# Altium project KX1_DB.PrjPcb (part 2 of 2)

## Sheet KX1_DB_EX_CONN.SchDoc
size 508 x 381 mm
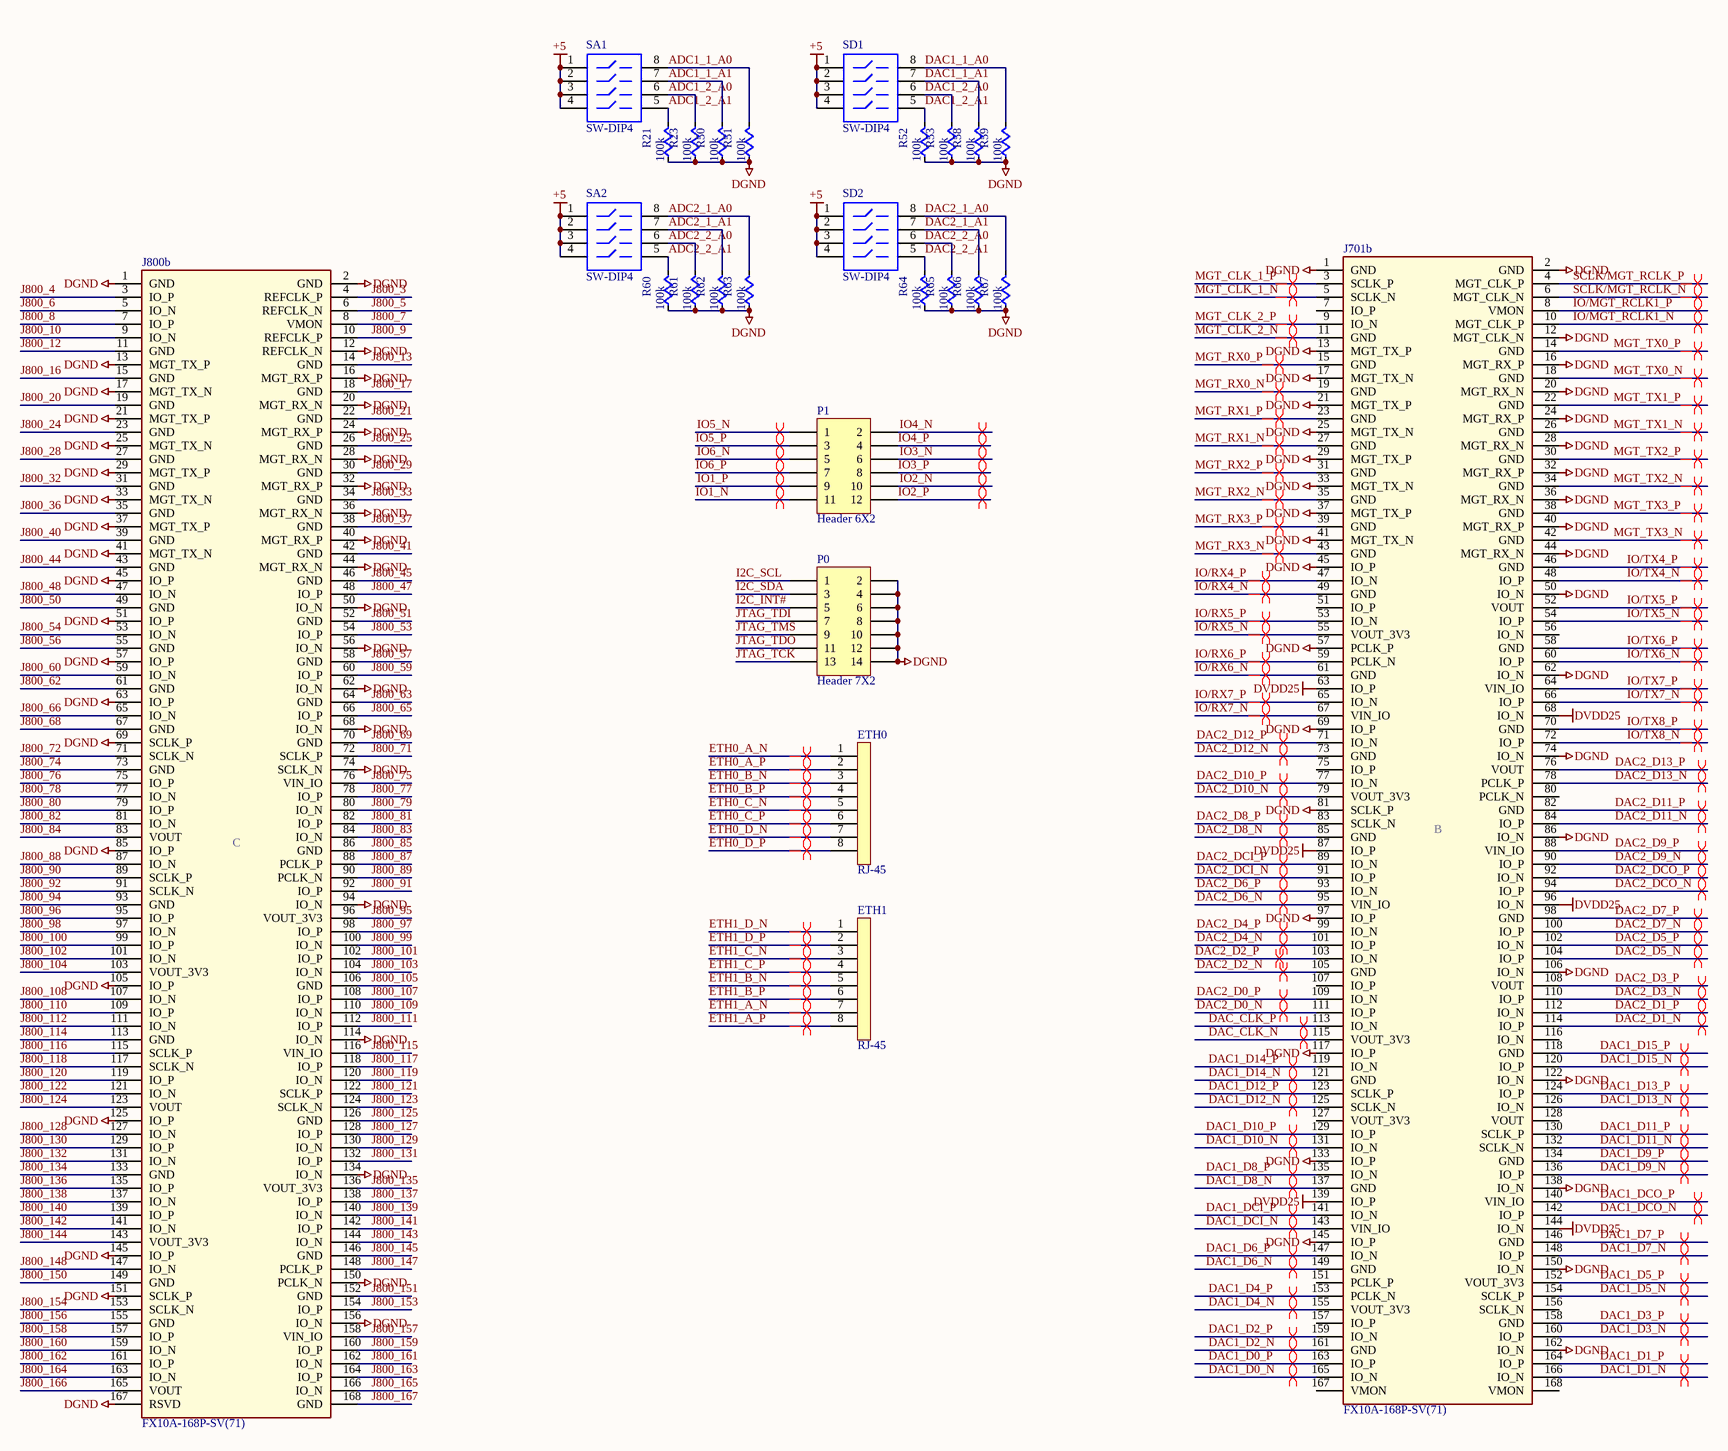
[diagram p3: KX1_DB_EX_CONN.SchDoc]

### Parts
ETH0  RJ-45  [SMD_ETHERNET]
ETH1  RJ-45  [SMD_ETHERNET]
J701b  FX10A-168P-SV(71)  [Mercury_Baseboard_Connector]
J800b  FX10A-168P-SV(71)  [Mercury_Baseboard_Connector]
P0  Header 7X2  [HDR2X7]
P1  Header 6X2  [HDR2X6]
R21  100k  [0603w]
R23  100k  [0603w]
R50  100k  [0603w]
R51  100k  [0603w]
R52  100k  [0603w]
R53  100k  [0603w]
R58  100k  [0603w]
R59  100k  [0603w]
R60  100k  [0603w]
R61  100k  [0603w]
R62  100k  [0603w]
R63  100k  [0603w]
R64  100k  [0603w]
R65  100k  [0603w]
R66  100k  [0603w]
R67  100k  [0603w]
SA1  SW-DIP4  [DIP-8]
SA2  SW-DIP4  [DIP-8]
SD1  SW-DIP4  [DIP-8]
SD2  SW-DIP4  [DIP-8]

### Nets
+5: SA1.1 SA1.2 SA1.3 SA1.4 SA2.1 SA2.2 SA2.3 SA2.4 SD1.1 SD1.2 SD1.3 SD1.4 SD2.1 SD2.2 SD2.3 SD2.4
DGND: J701b.1(GND) J701b.2(GND) J701b.12(MGT_CLK_N) J701b.13(MGT_TX_P) J701b.16(MGT_RX_P) J701b.17(MGT_TX_N) J701b.20(MGT_RX_N) J701b.21(MGT_TX_P) J701b.24(MGT_RX_P) J701b.25(MGT_TX_N) J701b.28(MGT_RX_N) J701b.29(MGT_TX_P) J701b.32(MGT_RX_P) J701b.33(MGT_TX_N) J701b.36(MGT_RX_N) J701b.37(MGT_TX_P) J701b.40(MGT_RX_P) J701b.41(MGT_TX_N) J701b.44(MGT_RX_N) J701b.45(IO_P) J701b.50(IO_N) J701b.57(PCLK_P) J701b.62(IO_N) J701b.69(IO_P) J701b.74(IO_N) J701b.81(SCLK_P) J701b.86(IO_N) J701b.97(IO_P) J701b.106(IO_N) J701b.117(IO_P) J701b.122(IO_N) J701b.133(IO_P) J701b.138(IO_N) J701b.145(IO_P) J701b.150(IO_N) J701b.162(IO_N) J800b.1(GND) J800b.2(GND) J800b.12(REFCLK_N) J800b.13(MGT_TX_P) J800b.16(MGT_RX_P) J800b.17(MGT_TX_N) J800b.20(MGT_RX_N) J800b.21(MGT_TX_P) J800b.24(MGT_RX_P) J800b.25(MGT_TX_N) J800b.28(MGT_RX_N) J800b.29(MGT_TX_P) J800b.32(MGT_RX_P) J800b.33(MGT_TX_N) J800b.36(MGT_RX_N) J800b.37(MGT_TX_P) J800b.40(MGT_RX_P) J800b.41(MGT_TX_N) J800b.44(MGT_RX_N) J800b.45(IO_P) J800b.50(IO_N) J800b.51(IO_P) J800b.56(IO_N) J800b.57(IO_P) J800b.62(IO_N) J800b.63(IO_P) J800b.68(IO_N) J800b.69(SCLK_P) J800b.74(SCLK_N) J800b.85(IO_P) J800b.94(IO_N) J800b.105(IO_P) J800b.114(IO_N) J800b.125(IO_P) J800b.134(IO_N) J800b.145(IO_P) J800b.150(PCLK_N) J800b.151(SCLK_P) J800b.156(IO_N) J800b.167(RSVD) P0.2 P0.4 P0.6 P0.8 P0.10 P0.12 P0.14 R21.1 R23.1 R50.1 R51.1 R52.1 R53.1 R58.1 R59.1 R60.1 R61.1 R62.1 R63.1 R64.1 R65.1 R66.1 R67.1  [project net AGND]
DVDD25: J701b.63(IO_P) J701b.68(IO_N) J701b.87(IO_P) J701b.96(IO_N) J701b.139(IO_P) J701b.144(IO_N)
ADC1_1_A0: R51.2 SA1.8
ADC1_1_A1: R50.2 SA1.7
ADC1_2_A0: R23.2 SA1.6
ADC1_2_A1: R21.2 SA1.5
ADC2_1_A0: R63.2 SA2.8
ADC2_1_A1: R62.2 SA2.7
ADC2_2_A0: R61.2 SA2.6
ADC2_2_A1: R60.2 SA2.5
DAC1_1_A0: R59.2 SD1.8
DAC1_1_A1: R58.2 SD1.7
DAC1_2_A0: R53.2 SD1.6
DAC1_2_A1: R52.2 SD1.5
DAC1_D0_N: J701b.165(IO_N)
DAC1_D0_P: J701b.163(IO_P)
DAC1_D1_N: J701b.166(IO_N)
DAC1_D1_P: J701b.164(IO_P)
DAC1_D2_N: J701b.161(GND)
DAC1_D2_P: J701b.159(IO_N)
DAC1_D3_N: J701b.160(IO_P)
DAC1_D3_P: J701b.158(GND)
DAC1_D4_N: J701b.155(VOUT_3V3)
DAC1_D4_P: J701b.153(PCLK_N)
DAC1_D5_N: J701b.154(SCLK_P)
DAC1_D5_P: J701b.152(VOUT_3V3)
DAC1_D6_N: J701b.149(GND)
DAC1_D6_P: J701b.147(IO_N)
DAC1_D7_N: J701b.148(IO_P)
DAC1_D7_P: J701b.146(GND)
DAC1_D8_N: J701b.137(GND)
DAC1_D8_P: J701b.135(IO_N)
DAC1_D9_N: J701b.136(IO_P)
DAC1_D9_P: J701b.134(GND)
DAC1_D10_N: J701b.131(IO_N)
DAC1_D10_P: J701b.129(IO_P)
DAC1_D11_N: J701b.132(SCLK_N)
DAC1_D11_P: J701b.130(SCLK_P)
DAC1_D12_N: J701b.125(SCLK_N)
DAC1_D12_P: J701b.123(SCLK_P)
DAC1_D13_N: J701b.126(IO_N)
DAC1_D13_P: J701b.124(IO_P)
DAC1_D14_N: J701b.121(GND)
DAC1_D14_P: J701b.119(IO_N)
DAC1_D15_N: J701b.120(IO_P)
DAC1_D15_P: J701b.118(GND)
DAC1_DCI_N: J701b.143(VIN_IO)
DAC1_DCI_P: J701b.141(IO_N)
DAC1_DCO_N: J701b.142(IO_P)
DAC1_DCO_P: J701b.140(VIN_IO)
DAC2_1_A0: R67.2 SD2.8
DAC2_1_A1: R66.2 SD2.7
DAC2_2_A0: R65.2 SD2.6
DAC2_2_A1: R64.2 SD2.5
DAC2_D0_N: J701b.111(IO_P)
DAC2_D0_P: J701b.109(IO_N)
DAC2_D1_N: J701b.114(IO_P)
DAC2_D1_P: J701b.112(IO_N)
DAC2_D2_N: J701b.105(GND)
DAC2_D2_P: J701b.103(IO_N)
DAC2_D3_N: J701b.110(IO_P)
DAC2_D3_P: J701b.108(VOUT)
DAC2_D4_N: J701b.101(IO_P)
DAC2_D4_P: J701b.99(IO_N)
DAC2_D5_N: J701b.104(IO_P)
DAC2_D5_P: J701b.102(IO_N)
DAC2_D6_N: J701b.95(VIN_IO)
DAC2_D6_P: J701b.93(IO_N)
DAC2_D7_N: J701b.100(IO_P)
DAC2_D7_P: J701b.98(GND)
DAC2_D8_N: J701b.85(GND)
DAC2_D8_P: J701b.83(SCLK_N)
DAC2_D9_N: J701b.90(IO_P)
DAC2_D9_P: J701b.88(VIN_IO)
DAC2_D10_N: J701b.79(VOUT_3V3)
DAC2_D10_P: J701b.77(IO_N)
DAC2_D11_N: J701b.84(IO_P)
DAC2_D11_P: J701b.82(GND)
DAC2_D12_N: J701b.73(GND)
DAC2_D12_P: J701b.71(IO_N)
DAC2_D13_N: J701b.78(PCLK_P)
DAC2_D13_P: J701b.76(VOUT)
DAC2_DCI_N: J701b.91(IO_P)
DAC2_DCI_P: J701b.89(IO_N)
DAC2_DCO_N: J701b.94(IO_P)
DAC2_DCO_P: J701b.92(IO_N)
DAC_CLK_N: J701b.115(VOUT_3V3)
DAC_CLK_P: J701b.113(IO_N)
ETH0_A_N: ETH0.1
ETH0_A_P: ETH0.2
ETH0_B_N: ETH0.3
ETH0_B_P: ETH0.4
ETH0_C_N: ETH0.5
ETH0_C_P: ETH0.6
ETH0_D_N: ETH0.7
ETH0_D_P: ETH0.8
ETH1_A_N: ETH1.7
ETH1_A_P: ETH1.8
ETH1_B_N: ETH1.5
ETH1_B_P: ETH1.6
ETH1_C_N: ETH1.3
ETH1_C_P: ETH1.4
ETH1_D_N: ETH1.1
ETH1_D_P: ETH1.2
I2C_INT#: P0.5
I2C_SCL: P0.1
I2C_SDA: P0.3
IO1_N: P1.11
IO1_P: P1.9
IO2_N: P1.10
IO2_P: P1.12
IO3_N: P1.6
IO3_P: P1.8
IO4_N: P1.2
IO4_P: P1.4
IO5_N: P1.1
IO5_P: P1.3
IO6_N: P1.5
IO6_P: P1.7
IO/MGT_RCLK1_N: J701b.10(MGT_CLK_P)
IO/MGT_RCLK1_P: J701b.8(VMON)
IO/RX4_N: J701b.49(GND)
IO/RX4_P: J701b.47(IO_N)
IO/RX5_N: J701b.55(VOUT_3V3)
IO/RX5_P: J701b.53(IO_N)
IO/RX6_N: J701b.61(GND)
IO/RX6_P: J701b.59(PCLK_N)
IO/RX7_N: J701b.67(VIN_IO)
IO/RX7_P: J701b.65(IO_N)
IO/TX4_N: J701b.48(IO_P)
IO/TX4_P: J701b.46(GND)
IO/TX5_N: J701b.54(IO_P)
IO/TX5_P: J701b.52(VOUT)
IO/TX6_N: J701b.60(IO_P)
IO/TX6_P: J701b.58(GND)
IO/TX7_N: J701b.66(IO_P)
IO/TX7_P: J701b.64(VIN_IO)
IO/TX8_N: J701b.72(IO_P)
IO/TX8_P: J701b.70(GND)
J800_3: J800b.4(REFCLK_P)
J800_4: J800b.3(IO_P)
J800_5: J800b.6(REFCLK_N)
J800_6: J800b.5(IO_N)
J800_7: J800b.8(VMON)
J800_8: J800b.7(IO_P)
J800_9: J800b.10(REFCLK_P)
J800_10: J800b.9(IO_N)
J800_12: J800b.11(GND)
J800_13: J800b.14(GND)
J800_16: J800b.15(GND)
J800_17: J800b.18(GND)
J800_20: J800b.19(GND)
J800_21: J800b.22(GND)
J800_24: J800b.23(GND)
J800_25: J800b.26(GND)
J800_28: J800b.27(GND)
J800_29: J800b.30(GND)
J800_32: J800b.31(GND)
J800_33: J800b.34(GND)
J800_36: J800b.35(GND)
J800_37: J800b.38(GND)
J800_40: J800b.39(GND)
J800_41: J800b.42(GND)
J800_44: J800b.43(GND)
J800_45: J800b.46(GND)
J800_47: J800b.48(IO_P)
J800_48: J800b.47(IO_N)
J800_50: J800b.49(GND)
J800_51: J800b.52(GND)
J800_53: J800b.54(IO_P)
J800_54: J800b.53(IO_N)
J800_56: J800b.55(GND)
J800_57: J800b.58(GND)
J800_59: J800b.60(IO_P)
J800_60: J800b.59(IO_N)
J800_62: J800b.61(GND)
J800_63: J800b.64(GND)
J800_65: J800b.66(IO_P)
J800_66: J800b.65(IO_N)
J800_68: J800b.67(GND)
J800_69: J800b.70(GND)
J800_71: J800b.72(SCLK_P)
J800_72: J800b.71(SCLK_N)
J800_74: J800b.73(GND)
J800_75: J800b.76(VIN_IO)
J800_76: J800b.75(IO_P)
J800_77: J800b.78(IO_P)
J800_78: J800b.77(IO_N)
J800_79: J800b.80(IO_N)
J800_80: J800b.79(IO_P)
J800_81: J800b.82(IO_P)
J800_82: J800b.81(IO_N)
J800_83: J800b.84(IO_N)
J800_84: J800b.83(VOUT)
J800_85: J800b.86(GND)
J800_87: J800b.88(PCLK_P)
J800_88: J800b.87(IO_N)
J800_89: J800b.90(PCLK_N)
J800_90: J800b.89(SCLK_P)
J800_91: J800b.92(IO_P)
J800_92: J800b.91(SCLK_N)
J800_94: J800b.93(GND)
J800_95: J800b.96(VOUT_3V3)
J800_96: J800b.95(IO_P)
J800_97: J800b.98(IO_P)
J800_98: J800b.97(IO_N)
J800_99: J800b.100(IO_N)
J800_100: J800b.99(IO_P)
J800_101: J800b.102(IO_P)
J800_102: J800b.101(IO_N)
J800_103: J800b.104(IO_N)
J800_104: J800b.103(VOUT_3V3)
J800_105: J800b.106(GND)
J800_107: J800b.108(IO_P)
J800_108: J800b.107(IO_N)
J800_109: J800b.110(IO_N)
J800_110: J800b.109(IO_P)
J800_111: J800b.112(IO_P)
J800_112: J800b.111(IO_N)
J800_114: J800b.113(GND)
J800_115: J800b.116(VIN_IO)
J800_116: J800b.115(SCLK_P)
J800_117: J800b.118(IO_P)
J800_118: J800b.117(SCLK_N)
J800_119: J800b.120(IO_N)
J800_120: J800b.119(IO_P)
J800_121: J800b.122(SCLK_P)
J800_122: J800b.121(IO_N)
J800_123: J800b.124(SCLK_N)
J800_124: J800b.123(VOUT)
J800_125: J800b.126(GND)
J800_127: J800b.128(IO_P)
J800_128: J800b.127(IO_N)
J800_129: J800b.130(IO_N)
J800_130: J800b.129(IO_P)
J800_131: J800b.132(IO_P)
J800_132: J800b.131(IO_N)
J800_134: J800b.133(GND)
J800_135: J800b.136(VOUT_3V3)
J800_136: J800b.135(IO_P)
J800_137: J800b.138(IO_P)
J800_138: J800b.137(IO_N)
J800_139: J800b.140(IO_N)
J800_140: J800b.139(IO_P)
J800_141: J800b.142(IO_P)
J800_142: J800b.141(IO_N)
J800_143: J800b.144(IO_N)
J800_144: J800b.143(VOUT_3V3)
J800_145: J800b.146(GND)
J800_147: J800b.148(PCLK_P)
J800_148: J800b.147(IO_N)
J800_150: J800b.149(GND)
J800_151: J800b.152(GND)
J800_153: J800b.154(IO_P)
J800_154: J800b.153(SCLK_N)
J800_156: J800b.155(GND)
J800_157: J800b.158(VIN_IO)
J800_158: J800b.157(IO_P)
J800_159: J800b.160(IO_P)
J800_160: J800b.159(IO_N)
J800_161: J800b.162(IO_N)
J800_162: J800b.161(IO_P)
J800_163: J800b.164(IO_P)
J800_164: J800b.163(IO_N)
J800_165: J800b.166(IO_N)
J800_166: J800b.165(VOUT)
J800_167: J800b.168(GND)
JTAG_TCK: P0.13
JTAG_TDI: P0.7
JTAG_TDO: P0.11
JTAG_TMS: P0.9
MGT_CLK_1_N: J701b.5(SCLK_N)
MGT_CLK_1_P: J701b.3(SCLK_P)
MGT_CLK_2_N: J701b.11(GND)
MGT_CLK_2_P: J701b.9(IO_N)
MGT_RX0_N: J701b.19(GND)
MGT_RX0_P: J701b.15(GND)
MGT_RX1_N: J701b.27(GND)
MGT_RX1_P: J701b.23(GND)
MGT_RX2_N: J701b.35(GND)
MGT_RX2_P: J701b.31(GND)
MGT_RX3_N: J701b.43(GND)
MGT_RX3_P: J701b.39(GND)
MGT_TX0_N: J701b.18(GND)
MGT_TX0_P: J701b.14(GND)
MGT_TX1_N: J701b.26(GND)
MGT_TX1_P: J701b.22(GND)
MGT_TX2_N: J701b.34(GND)
MGT_TX2_P: J701b.30(GND)
MGT_TX3_N: J701b.42(GND)
MGT_TX3_P: J701b.38(GND)
SCLK/MGT_RCLK_N: J701b.6(MGT_CLK_N)
SCLK/MGT_RCLK_P: J701b.4(MGT_CLK_P)

Not connected (* = marked no-connect by the designer): J701b 7(IO_P) 51(IO_P) 56(IO_N) 75(IO_P) 80(PCLK_N) 107(IO_P) 116(IO_N) 127(VOUT_3V3) 128(VOUT) 151(PCLK_P) 156(SCLK_N) 157(IO_P) 167(VMON) 168(VMON)

### Layout directives
differential pair: DAC1_D0_N, DAC1_D0_P, DAC1_D1_N, DAC1_D1_P, DAC1_D2_N, DAC1_D2_P, DAC1_D3_N, DAC1_D3_P, DAC1_D4_N, DAC1_D4_P, DAC1_D5_N, DAC1_D5_P, DAC1_D6_N, DAC1_D6_P, DAC1_D7_N, DAC1_D7_P, DAC1_D8_N, DAC1_D8_P, DAC1_D9_N, DAC1_D9_P, DAC1_D10_N, DAC1_D10_P, DAC1_D11_N, DAC1_D11_P, DAC1_D12_N, DAC1_D12_P, DAC1_D13_N, DAC1_D13_P, DAC1_D14_N, DAC1_D14_P, DAC1_D15_N, DAC1_D15_P, DAC1_DCI_N, DAC1_DCI_P, DAC1_DCO_N, DAC1_DCO_P, DAC2_D0_N, DAC2_D0_P, DAC2_D1_N, DAC2_D1_P, DAC2_D2_N, DAC2_D2_P, DAC2_D3_N, DAC2_D3_P, DAC2_D4_N, DAC2_D4_P, DAC2_D5_N, DAC2_D5_P, DAC2_D6_N, DAC2_D6_P, DAC2_D7_N, DAC2_D7_P, DAC2_D8_N, DAC2_D8_P, DAC2_D9_N, DAC2_D9_P, DAC2_D10_N, DAC2_D10_P, DAC2_D11_N, DAC2_D11_P, DAC2_D12_N, DAC2_D12_P, DAC2_D13_N, DAC2_D13_P, DAC2_DCI_N, DAC2_DCI_P, DAC2_DCO_N, DAC2_DCO_P, DAC_CLK_N, DAC_CLK_P, ETH0_A_N, ETH0_A_P, ETH0_B_N, ETH0_B_P, ETH0_C_N, ETH0_C_P, ETH0_D_N, ETH0_D_P, ETH1_A_N, ETH1_A_P, ETH1_B_N, ETH1_B_P, ETH1_C_N, ETH1_C_P, ETH1_D_N, ETH1_D_P, IO1_N, IO1_P, IO2_N, IO2_P, IO3_N, IO3_P, IO4_N, IO4_P, IO5_N, IO5_P, IO6_N, IO6_P, IO/MGT_RCLK1_N, IO/MGT_RCLK1_P, IO/RX4_N, IO/RX4_P, IO/RX5_N, IO/RX5_P, IO/RX6_N, IO/RX6_P, IO/RX7_N, IO/RX7_P, IO/TX4_N, IO/TX4_P, IO/TX5_N, IO/TX5_P, IO/TX6_N, IO/TX6_P, IO/TX7_N, IO/TX7_P, IO/TX8_N, IO/TX8_P, MGT_CLK_1_N, MGT_CLK_1_P, MGT_CLK_2_N, MGT_CLK_2_P, MGT_RX0_N, MGT_RX0_P, MGT_RX1_N, MGT_RX1_P, MGT_RX2_N, MGT_RX2_P, MGT_RX3_N, MGT_RX3_P, MGT_TX0_N, MGT_TX0_P, MGT_TX1_N, MGT_TX1_P, MGT_TX2_N, MGT_TX2_P, MGT_TX3_N, MGT_TX3_P, SCLK/MGT_RCLK_N, SCLK/MGT_RCLK_P

### Notes on the sheet
- (in symbol Mercury_Baseboard_Connector-B) B
- (in symbol Mercury_Baseboard_Connector-C) C

### Library data of the parts
ETH0 ETH1 = SIP8: ethernet connector; Supplier 1: Digi-Key; Supplier Part Number 1: RJSSE-5080-ND
J701b = Mercury_Baseboard_Connector-B: Mercury Baseboard Connector; Manufacturer: Hirose; DistPartNumber: FX10A-168P-SV(71)-ND; Board_Variant: ALL; Check Sch: CG_2015-03-03; Enclustra PN: EN100374; Geometry.Height: 4mm stack height; Distributor: Digikey; Package: SMD - 168pin Hirose; ROHS: Yes; Characteristics: -; Supplier: Enclustra; Check PCB: -; Cost: 4.50; ManufPartNumber: FX10A-168P-SV(71); Temperature: -55..+85°C; Type: Connector; Value: FX10A-168P-SV(71)
J800b = Mercury_Baseboard_Connector-C: Mercury Baseboard Connector; Manufacturer: Hirose; DistPartNumber: FX10A-168P-SV(71)-ND; Board_Variant: ALL; Check Sch: CG_2015-03-03; Enclustra PN: EN100374; Geometry.Height: 4mm stack height; Distributor: Digikey; Package: SMD - 168pin Hirose; ROHS: Yes; Characteristics: -; Supplier: Enclustra; Check PCB: -; Cost: 4.50; ManufPartNumber: FX10A-168P-SV(71); Temperature: -55..+85°C; Type: Connector; Value: FX10A-168P-SV(71)
P0 = Header 7X2: Header, 7-Pin, Dual row; LatestRevisionDate: 17-Jul-2002; LatestRevisionNote: Re-released for DXP Platform.; Publisher: Altium Limited
P1 = Header 6X2: Header, 6-Pin, Dual row; LatestRevisionDate: 17-Jul-2002; LatestRevisionNote: Re-released for DXP Platform.; Publisher: Altium Limited
R21 R23 R50-R53 R58-R67 = RES_SM: resistor; Manufacturer: Yageo; Manufacturer Part Number: RC0603FR-0776K8L; Resistance (Ohms): 76.8K; Power (Watts): 0.1W, 1/10W; Temperature Coefficient: ±100ppm/°C; Tolerance: ±1%; Supplier 1: Digi-Key; Supplier Part Number 1: 311-76.8KHRCT-ND; RoHS: RoHS Compliant; Category: Resistors; Stock 1: 91480; Pricing 1: 10=0.014, 50=0.0104, 100=0.0079, 250=0.00584, 500=0.00432, 1000=0.00288 (USD); Composition: Thick Film; Features: -; Size / Dimension: 0.063" L x 0.031" W (1.60mm x 0.80mm); Height: 0.018" (0.45mm); Number of Terminations: 2; Packaging: Cut Tape (CT); Package / Case: 0603 (1608 Metric); ComponentLink1URL: http://www.yageo.com/documents/recent/PYu-RC0603_51_RoHS_L_4.pdf; ComponentLink1Description: http://www.yageo.com/documents/recent/PYu-RC0603_51_RoHS_L_4.pdf
SA1 SA2 SD1 SD2 = SW-DIP4: DIP Switch; Published: 24-Mar-1999; LatestRevisionDate: 17-Jul-2002; LatestRevisionNote: Re-released for DXP Platform.; PackageReference: DIP-8; Publisher: Altium Limited

## Nets that join several sheets
+5: KX1_DB_PWR (C59.1 L8.2), KX1_DB_ADC_2 (7 pins), KX1_DB_EX_CONN (16 pins)
+15: KX1_DB_PWR (C61.1 C98.1 L10.2 L26.2), KX1_DB_ADC_2 (C20.1 C33.1 U8.8 U10.8), KX1_DB_DAC_1 (C42.2 C45.2 U13.8 U14.8)
-15: KX1_DB_PWR (C63.2 C104.2 L12.2 L28.2), KX1_DB_ADC_2 (6 pins), KX1_DB_DAC_1 (6 pins)
AGND: KX1_DB_PWR (44 pins), KX1_DB_ADC_2 (47 pins), KX1_DB_DAC_1 (36 pins), KX1_DB_EX_CONN (99 pins)
AVDD18: KX1_DB_PWR (C69.1 L16.2), KX1_DB_ADC_2 (6 pins)
AVDD33: KX1_DB_PWR (6 pins), KX1_DB_DAC_1 (6 pins)
CVDD18: KX1_DB_PWR (C66.1 L14.2), KX1_DB_DAC_1 (5 pins)
DVDD18: KX1_DB_PWR (C71.1 L18.2), KX1_DB_DAC_1 (C79.2 C80.2 U12.8 U12.47)
DVDD25: KX1_DB_PWR (6 pins), KX1_DB_EX_CONN (6 pins)
DVDD33: KX1_DB_PWR (6 pins), KX1_DB_DAC_1 (C77.1 U12.27)
OVDD18: KX1_DB_PWR (C84.1 L22.2), KX1_DB_ADC_2 (C96.2 U7.34)
ADC2_1_A0: KX1_DB_ADC_2 (U8.5), KX1_DB_EX_CONN (R63.2 SA2.8)
ADC2_1_A1: KX1_DB_ADC_2 (U8.4), KX1_DB_EX_CONN (R62.2 SA2.7)
ADC2_2_A0: KX1_DB_ADC_2 (U10.5), KX1_DB_EX_CONN (R61.2 SA2.6)
ADC2_2_A1: KX1_DB_ADC_2 (U10.4), KX1_DB_EX_CONN (R60.2 SA2.5)
DAC1_1_A0: KX1_DB_DAC_1 (U13.5), KX1_DB_EX_CONN (R59.2 SD1.8)
DAC1_1_A1: KX1_DB_DAC_1 (U13.4), KX1_DB_EX_CONN (R58.2 SD1.7)
DAC1_2_A0: KX1_DB_DAC_1 (U14.5), KX1_DB_EX_CONN (R53.2 SD1.6)
DAC1_2_A1: KX1_DB_DAC_1 (U14.4), KX1_DB_EX_CONN (R52.2 SD1.5)
DAC1_D0_N: KX1_DB_DAC_1 (U12.46), KX1_DB_EX_CONN (J701b.165)
DAC1_D0_P: KX1_DB_DAC_1 (U12.45), KX1_DB_EX_CONN (J701b.163)
DAC1_D1_N: KX1_DB_DAC_1 (U12.44), KX1_DB_EX_CONN (J701b.166)
DAC1_D1_P: KX1_DB_DAC_1 (U12.43), KX1_DB_EX_CONN (J701b.164)
DAC1_D2_N: KX1_DB_DAC_1 (U12.42), KX1_DB_EX_CONN (J701b.161)
DAC1_D2_P: KX1_DB_DAC_1 (U12.41), KX1_DB_EX_CONN (J701b.159)
DAC1_D3_N: KX1_DB_DAC_1 (U12.40), KX1_DB_EX_CONN (J701b.160)
DAC1_D3_P: KX1_DB_DAC_1 (U12.39), KX1_DB_EX_CONN (J701b.158)
DAC1_D4_N: KX1_DB_DAC_1 (U12.38), KX1_DB_EX_CONN (J701b.155)
DAC1_D4_P: KX1_DB_DAC_1 (U12.37), KX1_DB_EX_CONN (J701b.153)
DAC1_D5_N: KX1_DB_DAC_1 (U12.36), KX1_DB_EX_CONN (J701b.154)
DAC1_D5_P: KX1_DB_DAC_1 (U12.35), KX1_DB_EX_CONN (J701b.152)
DAC1_D6_N: KX1_DB_DAC_1 (U12.34), KX1_DB_EX_CONN (J701b.149)
DAC1_D6_P: KX1_DB_DAC_1 (U12.33), KX1_DB_EX_CONN (J701b.147)
DAC1_D7_N: KX1_DB_DAC_1 (U12.32), KX1_DB_EX_CONN (J701b.148)
DAC1_D7_P: KX1_DB_DAC_1 (U12.31), KX1_DB_EX_CONN (J701b.146)
DAC1_D8_N: KX1_DB_DAC_1 (U12.24), KX1_DB_EX_CONN (J701b.137)
DAC1_D8_P: KX1_DB_DAC_1 (U12.23), KX1_DB_EX_CONN (J701b.135)
DAC1_D9_N: KX1_DB_DAC_1 (U12.22), KX1_DB_EX_CONN (J701b.136)
DAC1_D9_P: KX1_DB_DAC_1 (U12.21), KX1_DB_EX_CONN (J701b.134)
DAC1_D10_N: KX1_DB_DAC_1 (U12.20), KX1_DB_EX_CONN (J701b.131)
DAC1_D10_P: KX1_DB_DAC_1 (U12.19), KX1_DB_EX_CONN (J701b.129)
DAC1_D11_N: KX1_DB_DAC_1 (U12.18), KX1_DB_EX_CONN (J701b.132)
DAC1_D11_P: KX1_DB_DAC_1 (U12.17), KX1_DB_EX_CONN (J701b.130)
DAC1_D12_N: KX1_DB_DAC_1 (U12.16), KX1_DB_EX_CONN (J701b.125)
DAC1_D12_P: KX1_DB_DAC_1 (U12.15), KX1_DB_EX_CONN (J701b.123)
DAC1_D13_N: KX1_DB_DAC_1 (U12.14), KX1_DB_EX_CONN (J701b.126)
DAC1_D13_P: KX1_DB_DAC_1 (U12.13), KX1_DB_EX_CONN (J701b.124)
DAC1_D14_N: KX1_DB_DAC_1 (U12.12), KX1_DB_EX_CONN (J701b.121)
DAC1_D14_P: KX1_DB_DAC_1 (U12.11), KX1_DB_EX_CONN (J701b.119)
DAC1_D15_N: KX1_DB_DAC_1 (U12.10), KX1_DB_EX_CONN (J701b.120)
DAC1_D15_P: KX1_DB_DAC_1 (U12.9), KX1_DB_EX_CONN (J701b.118)
DAC1_DCI_N: KX1_DB_DAC_1 (U12.30), KX1_DB_EX_CONN (J701b.143)
DAC1_DCI_P: KX1_DB_DAC_1 (U12.29), KX1_DB_EX_CONN (J701b.141)
DAC1_DCO_N: KX1_DB_DAC_1 (U12.26), KX1_DB_EX_CONN (J701b.142)
DAC1_DCO_P: KX1_DB_DAC_1 (U12.25), KX1_DB_EX_CONN (J701b.140)
DAC_CLK_N: KX1_DB_DAC_1 (C38.1), KX1_DB_EX_CONN (J701b.115)
DAC_CLK_P: KX1_DB_DAC_1 (C37.1), KX1_DB_EX_CONN (J701b.113)